# EAGLE schematic Right Ear Board (EAGLE 8.6.0)
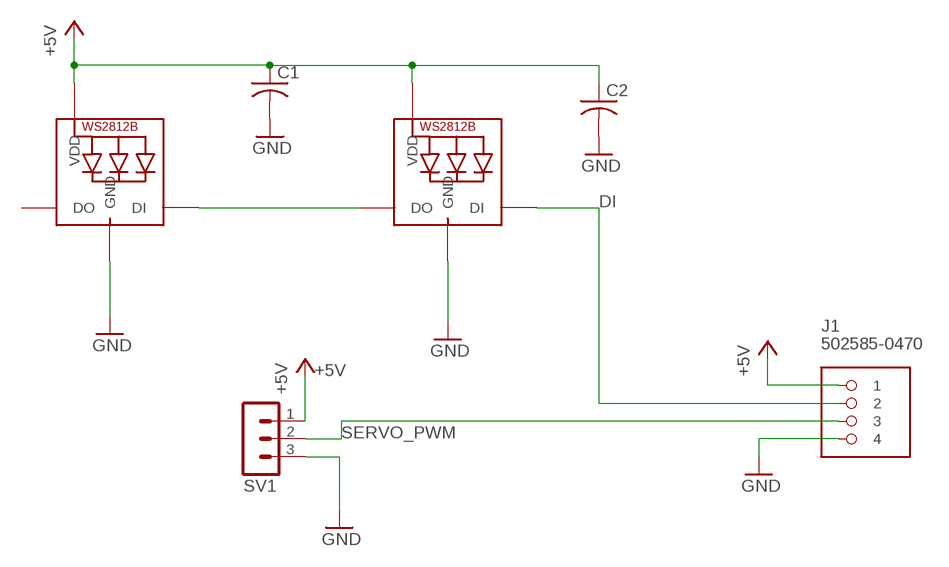
[diagram p0: schematic, sheet 1]

## Parts
C1  C-USC0402  [C0402]
C2  C-USC0402  [C0402]
J1  502585-0470  MOLEX_CLICKMATE-4-R/A  [MOLEX-CLIKMATE-4-R/A]
LED1  WS2812B5050  [WS2812B]
LED7  WS2812B5050  [WS2812B]
SV1  MA03-1  [MA03-1]

## Nets
+5V: C1.1 C2.1 J1.1 LED1.1-VDD(VDD) LED7.1-VDD(VDD) SV1.1
DI: J1.2 LED1.4-DIN(DI)
GND: C1.2 C2.2 J1.4 LED1.3-GND(GND) LED7.3-GND(GND) SV1.3
N$1: LED1.2-DOUT(DO) LED7.4-DIN(DI)
SERVO_PWM: J1.3 SV1.2
Unconnected: LED7.2-DOUT(DO)

## Library data of the parts
C1 C2 = rcl:C-US: CAPACITOR, American symbol
J1 = FormE:MOLEX_CLICKMATE-4-R/A
LED1 LED7 = adafruit:WS2812B
SV1 = con-lstb:MA03-1: PIN HEADER; OC_FARNELL: unknown; OC_NEWARK: unknown